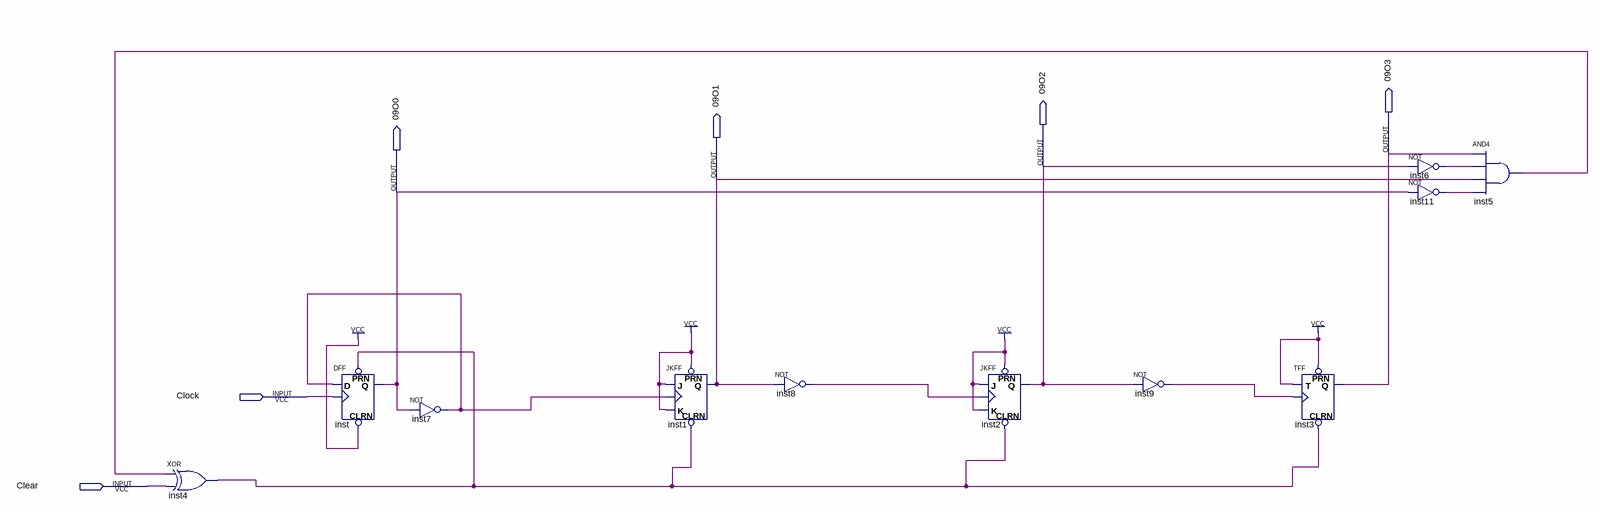
[diagram p0: schematic sheet]
// Quartus schematic Contador09.bdf as structural Verilog: 11 symbols, 6 pins
module Contador09 (
  input  Clock,
  input  Clear,
  output \09O3 ,
  output \09O2 ,
  output \09O1 ,
  output \09O0 
);

  wire inst4_out, inst5_out, inst6_out, inst7_out, inst8_out, inst9_out, inst11_out;

  xor inst4 (inst4_out, inst5_out, Clear);
  DFF inst (.CLRN(1'b1), .CLK(Clock), .D(inst7_out), .PRN(inst4_out), .Q(\09O0 ));
  not inst7 (inst7_out, \09O0 );
  JKFF inst1 (.PRN(1'b1), .CLRN(inst4_out), .K(1'b1), .J(1'b1), .CLK(inst7_out), .Q(\09O1 ));
  not inst8 (inst8_out, \09O1 );
  JKFF inst2 (.PRN(1'b1), .CLRN(inst4_out), .K(1'b1), .J(1'b1), .CLK(inst8_out), .Q(\09O2 ));
  not inst9 (inst9_out, \09O2 );
  TFF inst3 (.PRN(1'b1), .CLRN(inst4_out), .T(1'b1), .CLK(inst9_out), .Q(\09O3 ));
  not inst6 (inst6_out, \09O2 );
  not inst11 (inst11_out, \09O0 );
  and inst5 (inst5_out, \09O3 , inst6_out, \09O1 , inst11_out);
endmodule
